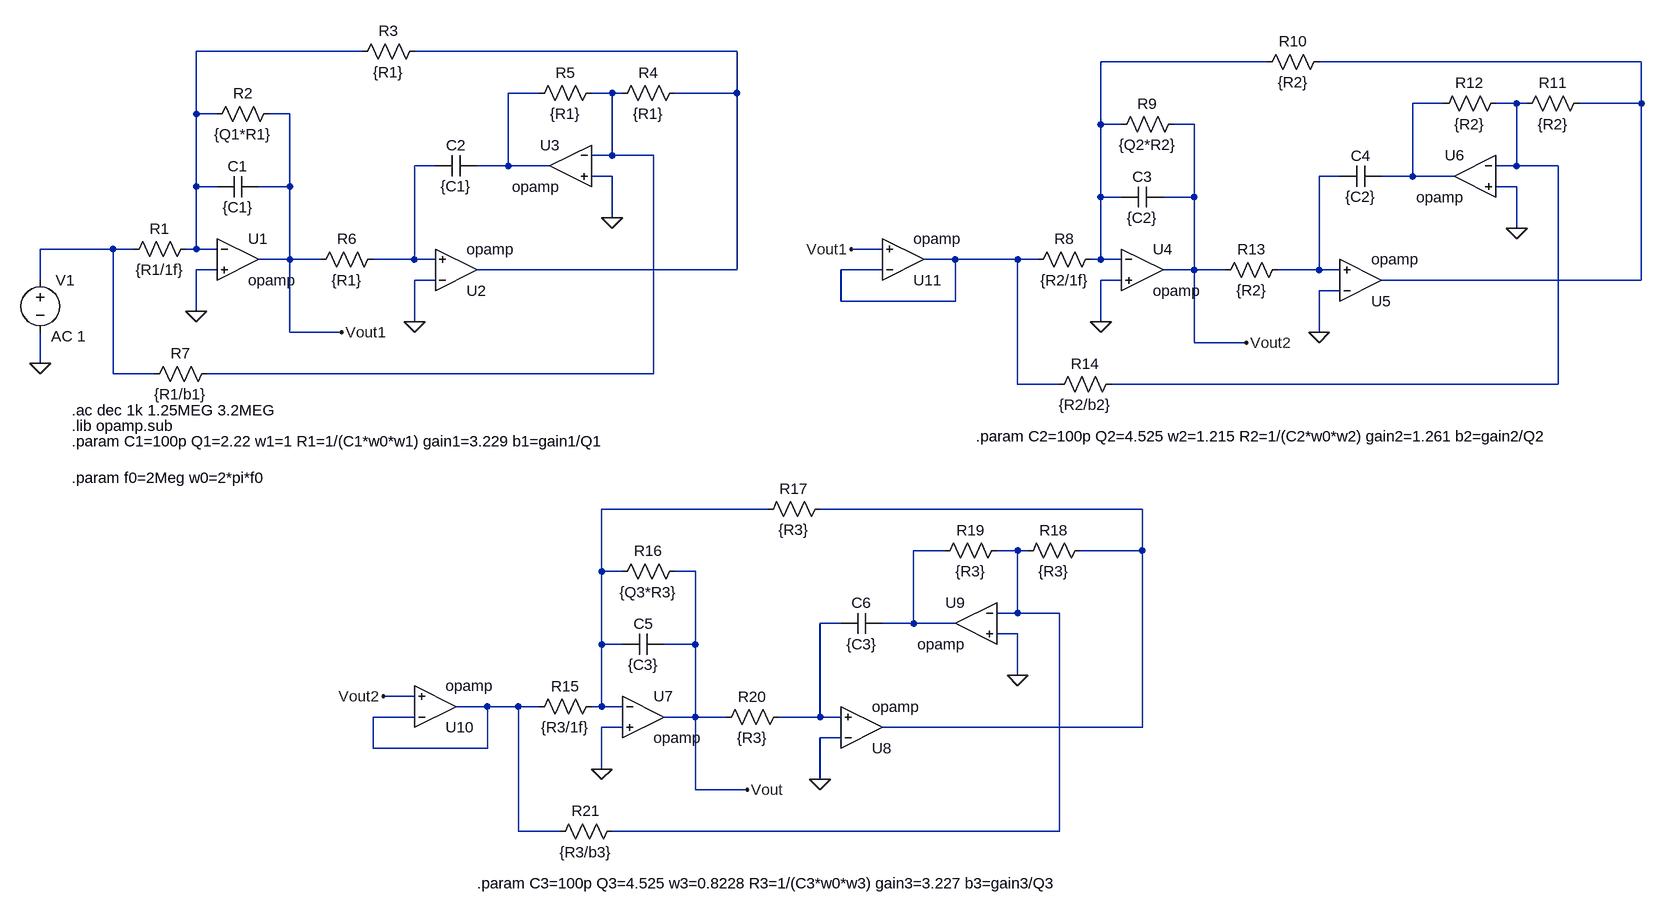
[diagram p0: schematic TS6.asc]
TS6.asc, the LTspice schematic file:
Version 4
SHEET 1 3672 1136
WIRE 96 -160 -160 -160
WIRE 672 -160 176 -160
WIRE 1488 -144 1232 -144
WIRE 2064 -144 1568 -144
WIRE 368 -96 320 -96
WIRE 480 -96 448 -96
WIRE 496 -96 480 -96
WIRE 672 -96 672 -160
WIRE 672 -96 576 -96
WIRE 1760 -80 1712 -80
WIRE 1872 -80 1840 -80
WIRE 1888 -80 1872 -80
WIRE 2064 -80 2064 -144
WIRE 2064 -80 1968 -80
WIRE -160 -64 -160 -160
WIRE -128 -64 -160 -64
WIRE -16 -64 -48 -64
WIRE 1232 -48 1232 -144
WIRE 1264 -48 1232 -48
WIRE 1376 -48 1344 -48
WIRE 480 0 480 -96
WIRE 480 0 448 0
WIRE 544 0 480 0
WIRE 208 16 176 16
WIRE 320 16 320 -96
WIRE 320 16 272 16
WIRE 384 16 320 16
WIRE 1872 16 1872 -80
WIRE 1872 16 1840 16
WIRE 1936 16 1872 16
WIRE 480 32 448 32
WIRE 1600 32 1568 32
WIRE 1712 32 1712 -80
WIRE 1712 32 1664 32
WIRE 1776 32 1712 32
WIRE -160 48 -160 -64
WIRE -128 48 -160 48
WIRE -16 48 -16 -64
WIRE -16 48 -64 48
WIRE 1872 48 1840 48
WIRE 1232 64 1232 -48
WIRE 1264 64 1232 64
WIRE 1376 64 1376 -48
WIRE 1376 64 1328 64
WIRE 480 96 480 32
WIRE 1872 112 1872 48
WIRE -288 144 -400 144
WIRE -256 144 -288 144
WIRE -160 144 -160 48
WIRE -160 144 -176 144
WIRE -128 144 -160 144
WIRE 896 144 848 144
WIRE -16 160 -16 48
WIRE -16 160 -64 160
WIRE 32 160 -16 160
WIRE 176 160 176 16
WIRE 176 160 112 160
WIRE 208 160 176 160
WIRE 1008 160 960 160
WIRE 1104 160 1008 160
WIRE 1136 160 1104 160
WIRE 1232 160 1232 64
WIRE 1232 160 1216 160
WIRE 1264 160 1232 160
WIRE -128 176 -160 176
WIRE 672 176 672 -96
WIRE 672 176 272 176
WIRE 896 176 832 176
WIRE 1376 176 1376 64
WIRE 1376 176 1328 176
WIRE 1424 176 1376 176
WIRE 1568 176 1568 32
WIRE 1568 176 1504 176
WIRE 1600 176 1568 176
WIRE -400 192 -400 144
WIRE 208 192 176 192
WIRE 1264 192 1232 192
WIRE 2064 192 2064 -80
WIRE 2064 192 1664 192
WIRE 1600 208 1568 208
WIRE 832 224 832 176
WIRE 1008 224 1008 160
WIRE 1008 224 832 224
WIRE -160 240 -160 176
WIRE 176 256 176 192
WIRE 1232 256 1232 192
WIRE -16 272 -16 160
WIRE 64 272 -16 272
WIRE 1568 272 1568 208
WIRE 1376 288 1376 176
WIRE 1456 288 1376 288
WIRE -400 320 -400 272
WIRE -288 336 -288 144
WIRE -224 336 -288 336
WIRE 544 336 544 0
WIRE 544 336 -144 336
WIRE 1104 352 1104 160
WIRE 1168 352 1104 352
WIRE 1936 352 1936 16
WIRE 1936 352 1248 352
WIRE 720 544 464 544
WIRE 1296 544 800 544
WIRE 992 608 944 608
WIRE 1104 608 1072 608
WIRE 1120 608 1104 608
WIRE 1296 608 1296 544
WIRE 1296 608 1200 608
WIRE 464 640 464 544
WIRE 496 640 464 640
WIRE 608 640 576 640
WIRE 1104 704 1104 608
WIRE 1104 704 1072 704
WIRE 1168 704 1104 704
WIRE 832 720 800 720
WIRE 944 720 944 608
WIRE 944 720 896 720
WIRE 1008 720 944 720
WIRE 1104 736 1072 736
WIRE 464 752 464 640
WIRE 496 752 464 752
WIRE 608 752 608 640
WIRE 608 752 560 752
WIRE 1104 800 1104 736
WIRE 176 832 128 832
WIRE 288 848 240 848
WIRE 336 848 288 848
WIRE 368 848 336 848
WIRE 464 848 464 752
WIRE 464 848 448 848
WIRE 496 848 464 848
WIRE 176 864 112 864
WIRE 608 864 608 752
WIRE 608 864 560 864
WIRE 656 864 608 864
WIRE 800 864 800 720
WIRE 800 864 736 864
WIRE 832 864 800 864
WIRE 496 880 464 880
WIRE 1296 880 1296 608
WIRE 1296 880 896 880
WIRE 832 896 800 896
WIRE 112 912 112 864
WIRE 288 912 288 848
WIRE 288 912 112 912
WIRE 464 944 464 880
WIRE 800 960 800 896
WIRE 608 976 608 864
WIRE 688 976 608 976
WIRE 336 1040 336 848
WIRE 400 1040 336 1040
WIRE 1168 1040 1168 704
WIRE 1168 1040 480 1040
FLAG -400 320 0
FLAG -160 240 0
FLAG 176 256 0
FLAG 480 96 0
FLAG 64 272 Vout1
FLAG 1232 256 0
FLAG 1568 272 0
FLAG 1872 112 0
FLAG 1456 288 Vout2
FLAG 464 944 0
FLAG 800 960 0
FLAG 1104 800 0
FLAG 688 976 Vout
FLAG 128 832 Vout2
FLAG 848 144 Vout1
SYMBOL OpAmps\\opamp -96 96 R0
SYMATTR InstName U1
SYMATTR SpiceLine2 GBW=500Meg
SYMBOL voltage -400 176 R0
WINDOW 123 17 102 Left 2
WINDOW 39 0 0 Left 0
SYMATTR Value2 AC 1
SYMATTR InstName V1
SYMATTR Value ""
SYMBOL OpAmps\\opamp 240 240 M180
SYMATTR InstName U2
SYMATTR SpiceLine2 GBW=500Meg
SYMBOL OpAmps\\opamp 416 -48 M0
SYMATTR InstName U3
SYMATTR SpiceLine2 GBW=500Meg
SYMBOL res -160 128 R90
WINDOW 0 0 56 VBottom 2
WINDOW 3 32 56 VTop 2
SYMATTR InstName R1
SYMATTR Value {R1/1f}
SYMBOL res -32 -80 R90
WINDOW 0 0 56 VBottom 2
WINDOW 3 32 56 VTop 2
SYMATTR InstName R2
SYMATTR Value {Q1*R1}
SYMBOL cap -64 32 R90
WINDOW 0 0 32 VBottom 2
WINDOW 3 32 32 VTop 2
SYMATTR InstName C1
SYMATTR Value {C1}
SYMBOL res 192 -176 R90
WINDOW 0 0 56 VBottom 2
WINDOW 3 32 56 VTop 2
SYMATTR InstName R3
SYMATTR Value {R1}
SYMBOL res 592 -112 R90
WINDOW 0 0 56 VBottom 2
WINDOW 3 32 56 VTop 2
SYMATTR InstName R4
SYMATTR Value {R1}
SYMBOL res 464 -112 R90
WINDOW 0 0 56 VBottom 2
WINDOW 3 32 56 VTop 2
SYMATTR InstName R5
SYMATTR Value {R1}
SYMBOL cap 272 0 R90
WINDOW 0 0 32 VBottom 2
WINDOW 3 32 32 VTop 2
SYMATTR InstName C2
SYMATTR Value {C1}
SYMBOL res 128 144 R90
WINDOW 0 0 56 VBottom 2
WINDOW 3 32 56 VTop 2
SYMATTR InstName R6
SYMATTR Value {R1}
SYMBOL res -128 320 R90
WINDOW 0 0 56 VBottom 2
WINDOW 3 32 56 VTop 2
SYMATTR InstName R7
SYMATTR Value {R1/b1}
SYMBOL OpAmps\\opamp 1296 112 R0
SYMATTR InstName U4
SYMATTR SpiceLine2 GBW=500Meg
SYMBOL OpAmps\\opamp 1632 256 M180
SYMATTR InstName U5
SYMATTR SpiceLine2 GBW=500Meg
SYMBOL OpAmps\\opamp 1808 -32 M0
SYMATTR InstName U6
SYMATTR SpiceLine2 GBW=500Meg
SYMBOL res 1232 144 R90
WINDOW 0 0 56 VBottom 2
WINDOW 3 32 56 VTop 2
SYMATTR InstName R8
SYMATTR Value {R2/1f}
SYMBOL res 1360 -64 R90
WINDOW 0 0 56 VBottom 2
WINDOW 3 32 56 VTop 2
SYMATTR InstName R9
SYMATTR Value {Q2*R2}
SYMBOL cap 1328 48 R90
WINDOW 0 0 32 VBottom 2
WINDOW 3 32 32 VTop 2
SYMATTR InstName C3
SYMATTR Value {C2}
SYMBOL res 1584 -160 R90
WINDOW 0 0 56 VBottom 2
WINDOW 3 32 56 VTop 2
SYMATTR InstName R10
SYMATTR Value {R2}
SYMBOL res 1984 -96 R90
WINDOW 0 0 56 VBottom 2
WINDOW 3 32 56 VTop 2
SYMATTR InstName R11
SYMATTR Value {R2}
SYMBOL res 1856 -96 R90
WINDOW 0 0 56 VBottom 2
WINDOW 3 32 56 VTop 2
SYMATTR InstName R12
SYMATTR Value {R2}
SYMBOL cap 1664 16 R90
WINDOW 0 0 32 VBottom 2
WINDOW 3 32 32 VTop 2
SYMATTR InstName C4
SYMATTR Value {C2}
SYMBOL res 1520 160 R90
WINDOW 0 0 56 VBottom 2
WINDOW 3 32 56 VTop 2
SYMATTR InstName R13
SYMATTR Value {R2}
SYMBOL res 1264 336 R90
WINDOW 0 0 56 VBottom 2
WINDOW 3 32 56 VTop 2
SYMATTR InstName R14
SYMATTR Value {R2/b2}
SYMBOL OpAmps\\opamp 528 800 R0
SYMATTR InstName U7
SYMATTR SpiceLine2 GBW=500Meg
SYMBOL OpAmps\\opamp 864 944 M180
SYMATTR InstName U8
SYMATTR SpiceLine2 GBW=500Meg
SYMBOL OpAmps\\opamp 1040 656 M0
SYMATTR InstName U9
SYMATTR SpiceLine2 GBW=500Meg
SYMBOL res 464 832 R90
WINDOW 0 0 56 VBottom 2
WINDOW 3 32 56 VTop 2
SYMATTR InstName R15
SYMATTR Value {R3/1f}
SYMBOL res 592 624 R90
WINDOW 0 0 56 VBottom 2
WINDOW 3 32 56 VTop 2
SYMATTR InstName R16
SYMATTR Value {Q3*R3}
SYMBOL cap 560 736 R90
WINDOW 0 0 32 VBottom 2
WINDOW 3 32 32 VTop 2
SYMATTR InstName C5
SYMATTR Value {C3}
SYMBOL res 816 528 R90
WINDOW 0 0 56 VBottom 2
WINDOW 3 32 56 VTop 2
SYMATTR InstName R17
SYMATTR Value {R3}
SYMBOL res 1216 592 R90
WINDOW 0 0 56 VBottom 2
WINDOW 3 32 56 VTop 2
SYMATTR InstName R18
SYMATTR Value {R3}
SYMBOL res 1088 592 R90
WINDOW 0 0 56 VBottom 2
WINDOW 3 32 56 VTop 2
SYMATTR InstName R19
SYMATTR Value {R3}
SYMBOL cap 896 704 R90
WINDOW 0 0 32 VBottom 2
WINDOW 3 32 32 VTop 2
SYMATTR InstName C6
SYMATTR Value {C3}
SYMBOL res 752 848 R90
WINDOW 0 0 56 VBottom 2
WINDOW 3 32 56 VTop 2
SYMATTR InstName R20
SYMATTR Value {R3}
SYMBOL res 496 1024 R90
WINDOW 0 0 56 VBottom 2
WINDOW 3 32 56 VTop 2
SYMATTR InstName R21
SYMATTR Value {R3/b3}
SYMBOL OpAmps\\opamp 208 912 M180
SYMATTR InstName U10
SYMATTR SpiceLine2 GBW=500Meg
SYMBOL OpAmps\\opamp 928 224 M180
SYMATTR InstName U11
SYMATTR SpiceLine2 GBW=500Meg
TEXT -352 392 Left 2 !.ac dec 1k 1.25MEG 3.2MEG
TEXT -352 416 Left 2 !.lib opamp.sub
TEXT -352 440 Left 2 !.param C1=100p Q1=2.22 w1=1 R1=1/(C1*w0*w1) gain1=3.229 b1=gain1/Q1
TEXT 1040 432 Left 2 !.param C2=100p Q2=4.525 w2=1.215 R2=1/(C2*w0*w2) gain2=1.261 b2=gain2/Q2
TEXT -352 496 Left 2 !.param f0=2Meg w0=2*pi*f0
TEXT 272 1120 Left 2 !.param C3=100p Q3=4.525 w3=0.8228 R3=1/(C3*w0*w3) gain3=3.227 b3=gain3/Q3

The netlist it stands for:
* TS6.asc
XU1 N001 0 Vout1 opamp Aol=100K GBW=500Meg  ; pins invin noninvin out
V1 N011 0 AC 1
XU2 0 N009 N002 opamp Aol=100K GBW=500Meg  ; pins invin noninvin out
XU3 N006 0 N005 opamp Aol=100K GBW=500Meg  ; pins invin noninvin out
R1 N001 N011 {R1/1f}
R2 Vout1 N001 {Q1*R1}
C1 Vout1 N001 {C1}
R3 N002 N001 {R1}
R4 N002 N006 {R1}
R5 N006 N005 {R1}
C2 N005 N009 {C1}
R6 N009 Vout1 {R1}
R7 N006 N011 {R1/b1}
XU4 N003 0 Vout2 opamp Aol=100K GBW=500Meg  ; pins invin noninvin out
XU5 0 N010 N004 opamp Aol=100K GBW=500Meg  ; pins invin noninvin out
XU6 N008 0 N007 opamp Aol=100K GBW=500Meg  ; pins invin noninvin out
R8 N003 N012 {R2/1f}
R9 Vout2 N003 {Q2*R2}
C3 Vout2 N003 {C2}
R10 N004 N003 {R2}
R11 N004 N008 {R2}
R12 N008 N007 {R2}
C4 N007 N010 {C2}
R13 N010 Vout2 {R2}
R14 N008 N012 {R2/b2}
XU7 N013 0 Vout opamp Aol=100K GBW=500Meg  ; pins invin noninvin out
XU8 0 N017 N014 opamp Aol=100K GBW=500Meg  ; pins invin noninvin out
XU9 N016 0 N015 opamp Aol=100K GBW=500Meg  ; pins invin noninvin out
R15 N013 N018 {R3/1f}
R16 Vout N013 {Q3*R3}
C5 Vout N013 {C3}
R17 N014 N013 {R3}
R18 N014 N016 {R3}
R19 N016 N015 {R3}
C6 N015 N017 {C3}
R20 N017 Vout {R3}
R21 N016 N018 {R3/b3}
XU10 N018 Vout2 N018 opamp Aol=100K GBW=500Meg  ; pins invin noninvin out
XU11 N012 Vout1 N012 opamp Aol=100K GBW=500Meg  ; pins invin noninvin out
.ac dec 1k 1.25MEG 3.2MEG
.lib opamp.sub
.param C1=100p Q1=2.22 w1=1 R1=1/(C1*w0*w1) gain1=3.229 b1=gain1/Q1
.param C2=100p Q2=4.525 w2=1.215 R2=1/(C2*w0*w2) gain2=1.261 b2=gain2/Q2
.param f0=2Meg w0=2*pi*f0
.param C3=100p Q3=4.525 w3=0.8228 R3=1/(C3*w0*w3) gain3=3.227 b3=gain3/Q3
.backanno
.end